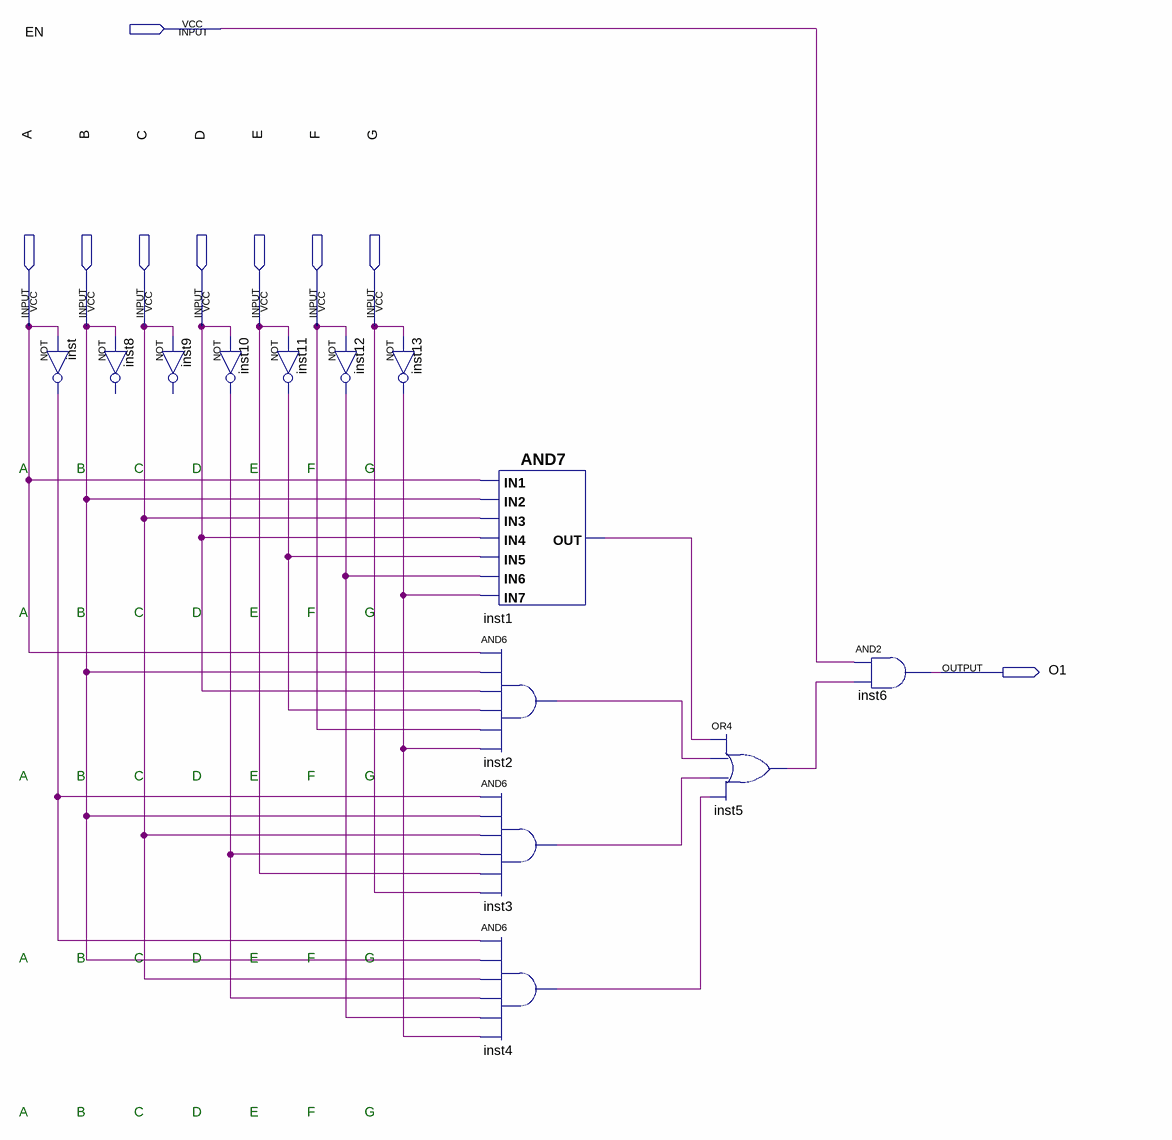
[diagram p0: schematic sheet]
// Quartus schematic linha3led4.bdf as structural Verilog: 13 symbols, 9 pins
module linha3led4 (
  input  EN,
  input  A,
  input  B,
  input  C,
  input  D,
  input  E,
  input  F,
  input  G,
  output O1
);

  wire inst1_out, inst2_out, inst3_out, inst4_out, inst5_out, inst10_out, inst11_out, inst12_out, inst13_out,
       inst_out;

  not inst (inst_out, A);
  // NOT inst8 has open pins: IN=B, OUT=open
  // NOT inst9 has open pins: IN=C, OUT=open
  not inst10 (inst10_out, D);
  not inst11 (inst11_out, E);
  not inst12 (inst12_out, F);
  not inst13 (inst13_out, G);
  and inst1 (inst1_out, A, B, C, D, inst11_out, inst12_out, inst13_out);
  and inst2 (inst2_out, A, B, D, inst11_out, F, inst13_out);
  and inst3 (inst3_out, inst_out, B, C, inst10_out, E, G);
  and inst4 (inst4_out, inst_out, B, C, inst10_out, inst12_out, inst13_out);
  or inst5 (inst5_out, inst1_out, inst2_out, inst3_out, inst4_out);
  and inst6 (O1, EN, inst5_out);

  // Notes on the sheet:
  //   A
  //   B
  //   C
  //   D
  //   E
  //   F
  //   G
  //   A
  //   B
  //   C
  //   D
  //   E
  //   F
  //   G
  //   A
  //   B
  //   C
  //   D
  //   E
  //   F
  //   G
  //   A
  //   B
  //   C
  //   D
  //   E
  //   F
  //   G
  //   A
  //   B
  //   C
  //   D
  //   E
  //   F
  //   G
endmodule
